# EAGLE schematic booster (EAGLE 7.5.0)
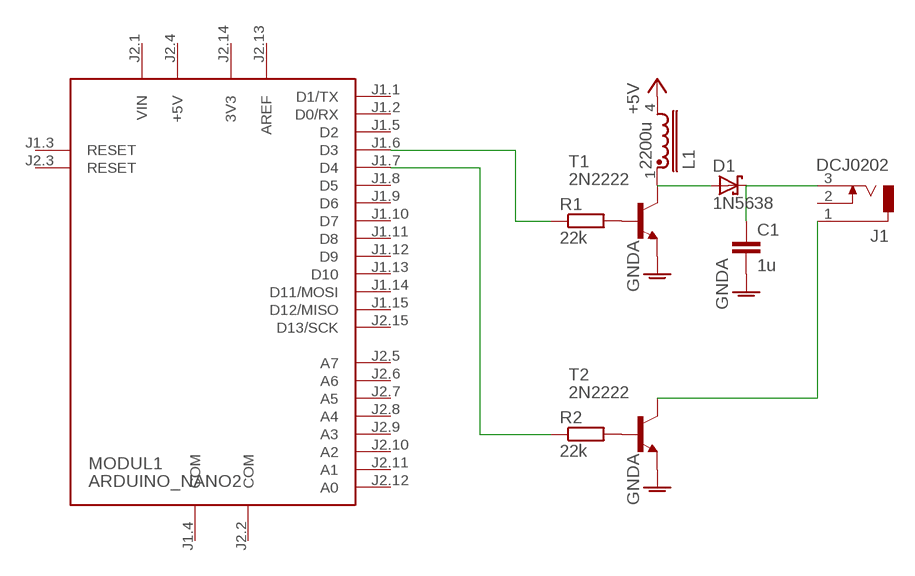
[diagram p0: schematic, sheet 1]

## Parts
C1  1u  C2.5/4  [C2.5-4]
D1  1N5638  [DO13M]
J1  DCJ0202  [DCJ0202]
L1  2200u  U15-CHOKE  [U15CHOKE]
MODUL1  ARDUINO_NANO2  [ARDUINO_NANO2]
R1  22k  R-EU_R0603  [R0603]
R2  22k  R-EU_R0603  [R0603]
T1  2N2222  [TO18]
T2  2N2222  [TO18]

## Nets
+5V: L1.4
GNDA: C1.2 T1.1(E) T2.1(E)
N$1: D1.A L1.1 T1.3(C)
N$2: R1.2 T1.2(B)
N$3: R2.2 T2.2(B)
N$4: C1.1 D1.C J1.3
N$5: J1.1 T2.3(C)
N$6: MODUL1.J1.6(D3) R1.1
N$7: MODUL1.J1.7(D4) R2.1
Unconnected: J1.2 MODUL1.J1.1(D1/TX) MODUL1.J1.2(D0/RX) MODUL1.J1.3(RESET) MODUL1.J1.5(D2) MODUL1.J1.8(D5) MODUL1.J1.9(D6) MODUL1.J1.10(D7) MODUL1.J1.11(D8) MODUL1.J1.12(D9) MODUL1.J1.13(D10) MODUL1.J1.14(D11/MOSI) MODUL1.J1.15(D12/MISO) MODUL1.J2.3(RESET) MODUL1.J2.5(A7) MODUL1.J2.6(A6) MODUL1.J2.7(A5) MODUL1.J2.8(A4) MODUL1.J2.9(A3) MODUL1.J2.10(A2) MODUL1.J2.11(A1) MODUL1.J2.12(A0) MODUL1.J2.15(D13/SCK)

## Power pins joined to a net without a drawn wire
3V3: MODUL1.J2.14(3V3)
+5V: MODUL1.J2.4(+5V)
AREF: MODUL1.J2.13(AREF)
COM: MODUL1.J1.4(COM) MODUL1.J2.2(COM)
VIN: MODUL1.J2.1(VIN)

## Library data of the parts
C1 = capacitor-wima:C: CAPACITOR naming: grid - package width
D1 = diode:1N5638: DIODE schottky
J1 = con-jack:DCJ0202: DC POWER JACK Source: DCJ0202.pdf; OC_FARNELL: unknown; OC_NEWARK: unknown
L1 = inductor-neosid:U15-: CHOKE U15; OC_FARNELL: unknown; OC_NEWARK: unknown
MODUL1 = arduino:ARDUINO_NANO2: Arduino Nano2 Auto generated by modulcreator.ulp \;; ANZAHL: 2; MODUL: TRUE; STECKX0: -76200; STECKX1: 76200; STECKY0: 177800; STECKY1: 177800
R1 R2 = resistor:R-EU_: RESISTOR, European symbol
T1 T2 = transistor-neu-to92:2N2222: NPN TRANSISTOR